# Altium schematic sheet 03-MCU.SchDoc: MCU
size A; Revision: A; SheetNumber: 3; SheetTotal: 6
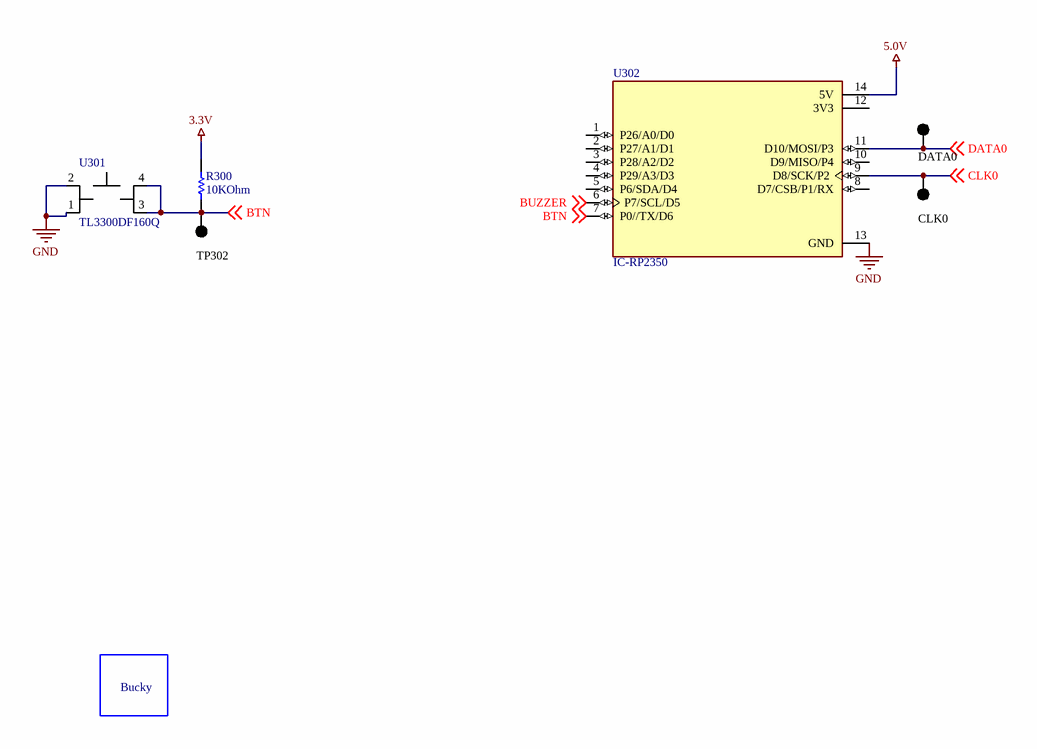
[diagram p0: 03-MCU.SchDoc]

## Parts
?  Bucky  [WalkingBucky]  (value not drawn)  (no BOM)
CLK0  5011  [KSTN-5011_V]  (value not drawn)
DATA0  5011  [KSTN-5011_V]  (value not drawn)
R300  Resistance: 10KOhm  [RESC3116X65X40ML10T20]  (hidden comment: RC1206FR-0710KL)
TP302  5011  [KSTN-5011_V]  (value not drawn)
U301  TL3300DF160Q  [TL3300DF160Q]
U302  IC-RP2350  [XIAO-RP2350]

## Nets
3.3V: R300.2
5.0V: U302.14(5V)
GND: U301.1 U301.2 U302.13(GND)
BTN: R300.1 TP302.1 U301.3 U301.4(VCCIO) U302.7(P0//TX/D6) ; off-sheet BTN
BUZZER: U302.6(P7/SCL/D5) ; off-sheet BUZZER
CLK0: CLK0.1 U302.9(D8/SCK/P2) ; off-sheet CLK0
DATA0: DATA0.1 U302.11(D10/MOSI/P3) ; off-sheet DATA0

Not connected (* = marked no-connect by the designer): U302 1(P26/A0/D0) 2(P27/A1/D1) 3(P28/A2/D2) 4(P29/A3/D3) 5(P6/SDA/D4) 8(D7/CSB/P1/RX) 10(D9/MISO/P4) 12(3V3)

## Notes on the sheet
- Title:
- Size:
- A
- Project
- Rev:
- Sheet:
- of
- College of Engineering
- 1415 Engineering Drive
- Madison, WI 53706

## Library data of the parts
? = Bucky: Bucky Badger Image; Manufacturer Part Number: UW Bucky
CLK0 DATA0 TP302 = CMP-1672-00003-4: Test Point, Black, Through Hole, RoHS, Bulk; Manufacturer: Keystone; ComponentLink2URL: http://www.keyelco.com/product-pdf.cfm?p=1320; Colour: Black; Pins: 1; REACH SVHC: No SVHC; ComponentLink1URL: http://www.keyelco.com/; PackageReference: 5011; Contact Plating: Silver; Package Quantity: 100; Packaging: Bulk; RoHSCompliant: true; Height: 8.12 mm; PackageDescription: 1-Pin Through Hole Device, Dia 3.17 mm; Mount: Through Hole; Mounting Technology: Through Hole; DatasheetVersion: Rev. F, 12/2013; ComponentLink1Description: Manufacturer URL; Contact Material: Bronze; ComponentLink2Description: Datasheet
R300 = CMP-1014-00623-2: Chip Resistor, 10 KOhm, +/- 1%, 0.25 W, -55 to 155 degC, 1206 (3216 Metric), RoHS, Tape and Reel; Manufacturer: Yageo; Voltage Rating: 200V; Temperature Coefficient: 100ppm/degreesC; Power Rating: 250mW; Packaging: TapeandReel; Termination: SMD/SMT; REACH SVHC: Unknown; Tolerance: 1%; Height: 0.55mm; Composition: ThickFilm; Max Operating Temperature: 155degC; Datasheet Version: Rev. 5, 10/2016; Lead Free: LeadFree; Case Code (Metric): 3216; Depth: 1.6mm; Package Quantity: 5000; RoHSCompliant: true; Military Standard: Not; Case/Package: 1206; Case Code (Imperial): 1206; Min Operating Temperature: -55degC; Datasheet URL: http://www.yageo.com/NewPortal/yageodocoutput?fileName=/pdf/R-Chip/PYu-RC_Group_51_RoHS_L_5.pdf; Length: 3.1mm; Manufacturer URL: http://www.yageo.com/; Package Reference: 1206.0; Width: 1.6mm; Package Description: 2-Pin Surface Mount Device, Body 3.1 x 1.6 mm
U301 = TL3300DF160Q: Switch Tactile OFF (ON) SPST Round Button Gull Wing 0.05A 12VDC 1.57N SMD; Manufacturer: E-Switch; Contact Rating @ Voltage: 0.05A @ 12VDC; Outline: 12.00mm x 12.00mm; Circuit: SPST-NO; Switch Travel: 0.35mm; Actuator Type: Standard; Mechanical Life: 200,000 Cycles; Switch Function: Off-Mom; Actuator Height off PCB, from Pins: 4.30mm; Illumination: Non-Illuminated; Operating Force: 160gf; Actuator Orientation: Top Actuated; Current Rating: 50mA; Voltage Rating (DC): 12V; Illumination Voltage (Nominal): -; Mounting Type: Surface Mount; Illumination Type, Color: -; Packaging: Cut Tape (CT); Ingress Protection: -; RoHS: RoHS Compliant; Actuator Material: -; Category: Switches; Manufacturer Part Number: TL3300DF160Q; Operating Temperature: -25°C ~ 70°C; Features: -; Termination Style: Gull Wing; Supplier: Digi-Key; Supplier Part Number: EG4906CT-ND; Supplier 1: Digi-Key; Supplier Part Number 1: EG4906CT-ND; Manufacturer 1: E-Switch; Manufacturer Part Number 1: TL3300DF160Q; Stock 1: 57403; Pricing 1: 1=0.60000, 10=0.57800, 25=0.55680, 100=0.48180, 250=0.43896 (USD); Mount: Surface Mount; Case/Package: SMD/SMT; Contact Plating: Silver; Min Operating Temperature: -25°C; Max Operating Temperature: 70°C; Package Quantity: 1; Termination: Gull Wing; Illumination Type: Non-Illuminated; Throw Configuration: SPST; Series: TL3300; RoHS Compliant: Yes; ComponentLink1URL: https://datasheet.ciiva.com/2900/n301101-2900856.pdf?src-supplier=Digi-Key; ComponentLink1Description: https://datasheet.ciiva.com/2900/n301101-2900856.pdf?src-supplier=Digi-Key; ComponentLink2URL: https://datasheet.ciiva.com/2900/n301101-2900858.pdf?src-supplier=Digi-Key; ComponentLink2Description: https://datasheet.ciiva.com/2900/n301101-2900858.pdf?src-supplier=Digi-Key
U302 = IC-RP2350: RP2350 XIAO; MF: Seeed Technology Co., Ltd; MP: 102010428; SnapEDA_Link: https://www.snapeda.com/parts/102010428/Seeed+Technology+Co.%252C+Ltd/view-part/?ref=snap; Package: None; Value: *; Check_prices: https://www.snapeda.com/parts/102010428/Seeed+Technology+Co.%252C+Ltd/view-part/?ref=eda